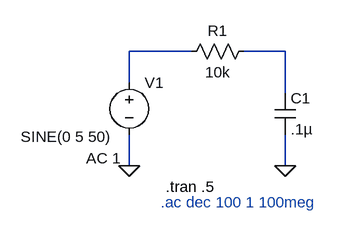
[diagram p0: schematic RC.asc]
RC.asc, the LTspice schematic file:
Version 4.1
SHEET 1 880 680
WIRE 112 48 16 48
WIRE 256 48 192 48
WIRE 16 96 16 48
WIRE 256 112 256 48
WIRE 16 224 16 176
WIRE 256 224 256 176
FLAG 16 224 0
FLAG 256 224 0
SYMBOL res 208 32 R90
WINDOW 0 0 56 VBottom 2
WINDOW 3 32 56 VTop 2
SYMATTR InstName R1
SYMATTR Value 10k
SYMBOL cap 240 112 R0
SYMATTR InstName C1
SYMATTR Value .1µ
SYMBOL voltage 16 80 R0
WINDOW 3 -167 99 Left 2
WINDOW 123 -66 132 Left 2
WINDOW 39 0 0 Left 0
SYMATTR Value SINE(0 5 50)
SYMATTR Value2 AC 1
SYMATTR InstName V1
TEXT 72 256 Left 2 !.tran .5
TEXT 64 280 Left 2 ;.ac dec 100 1 100meg

The netlist it stands for:
* RC.asc
R1 N002 N001 10k
C1 N002 0 .1µ
V1 N001 0 SINE(0 5 50) AC 1
.tran .5
* .ac dec 100 1 100meg
.backanno
.end